# Altium schematic sheet Memory.SchDoc
size A; Author: E. Sims; Organization: Let's Build Rockets Inc.; SheetNumber: 3; SheetTotal: 11
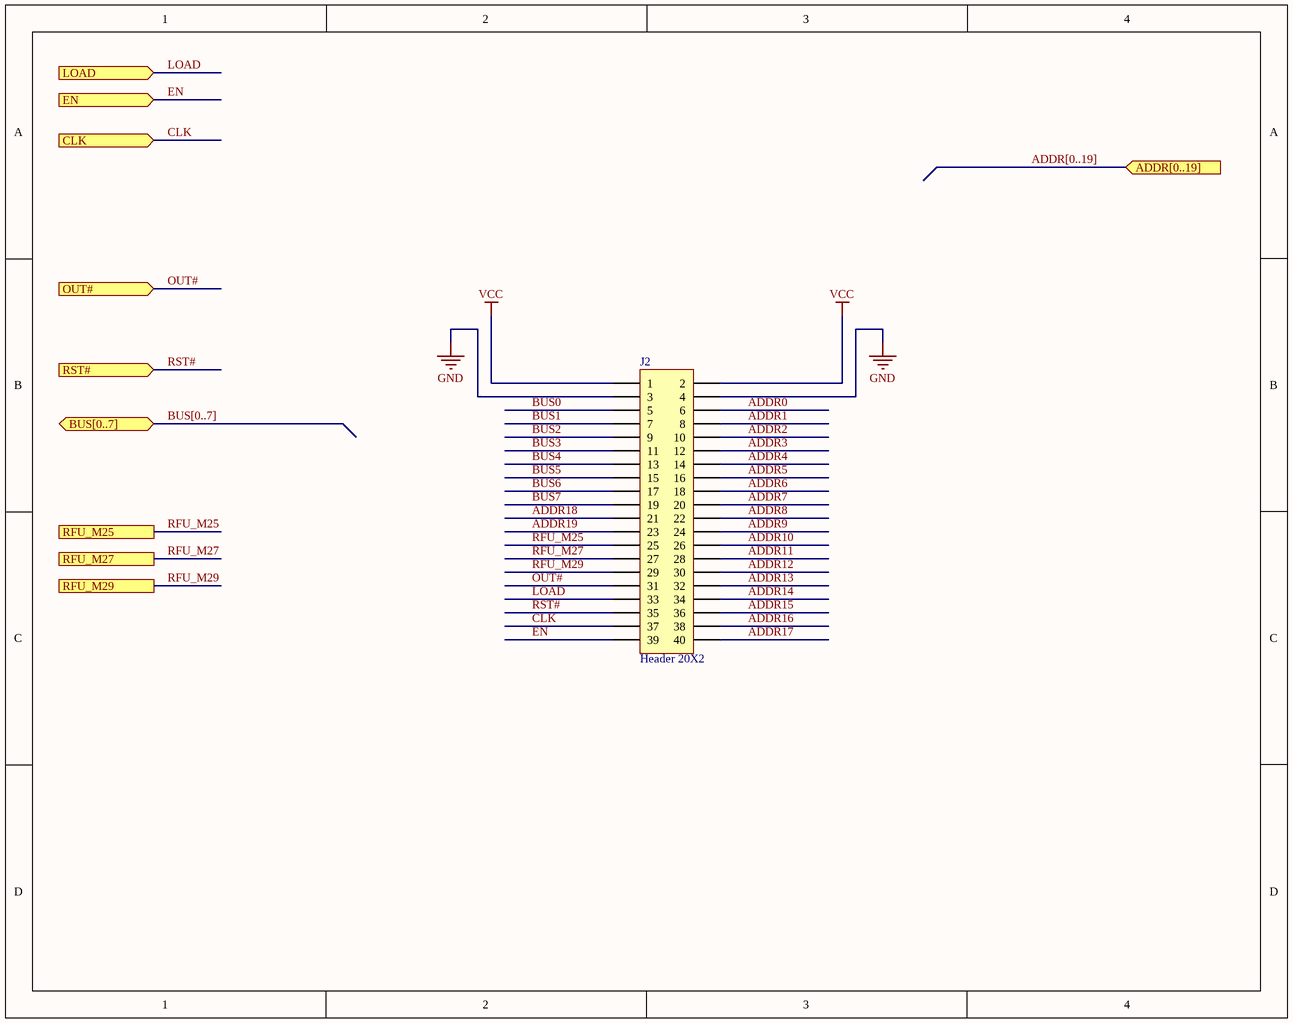
[diagram p0: Memory.SchDoc]

## Parts
J2  Header 20X2  [HDR2X20]

## Ports
ADDR[0..19] (in), BUS[0..7] (bidir), CLK (in), EN (in), LOAD (in), OUT# (in), RFU_M25, RFU_M27, RFU_M29, RST# (in)

## Nets
GND: J2.3 J2.4
VCC: J2.1 J2.2
ADDR0: J2.6
ADDR1: J2.8
ADDR2: J2.10
ADDR3: J2.12
ADDR4: J2.14
ADDR5: J2.16
ADDR6: J2.18
ADDR7: J2.20
ADDR8: J2.22
ADDR9: J2.24
ADDR10: J2.26
ADDR11: J2.28
ADDR12: J2.30
ADDR13: J2.32
ADDR14: J2.34
ADDR15: J2.36
ADDR16: J2.38
ADDR17: J2.40
ADDR18: J2.21
ADDR19: J2.23
BUS0: J2.5
BUS1: J2.7
BUS2: J2.9
BUS3: J2.11
BUS4: J2.13
BUS5: J2.15
BUS6: J2.17
BUS7: J2.19
CLK: J2.37 ; port CLK
EN: J2.39 ; port EN
LOAD: J2.33 ; port LOAD
OUT#: J2.31 ; port OUT#
RFU_M25: J2.25 ; port RFU_M25
RFU_M27: J2.27 ; port RFU_M27
RFU_M29: J2.29 ; port RFU_M29
RST#: J2.35 ; port RST#

## Buses and harness runs
bus ADDR[0..19] = port ADDR[0..19]
bus BUS[0..7] = port BUS[0..7]

## Notes on the sheet
- Let's Build Rocket's Inc. Modular Paylaod System Based on TMP-010 Rev
  For more information visit https://github.com/LetsBuildRockets/Modular-Payload-System
  This work is licensed under CC BY-NC 4.0. To view a copy of this license, visit https://creativecommons.org/licenses/by-nc/4.0
- Title
- Size:
- Date:
- Assembly Variant:
- B
- Number:
- Time:
- Revision:
- Sheet
- of
- Author:
- File:

## Library data of the parts
J2 = Header 20X2: Header, 20-Pin, Dual row; System: Connector; LatestRevisionDate: 17-Jul-2002; LatestRevisionNote: Re-released for DXP Platform.; Publisher: Altium Limited